# Altium project PCB_Project1.PrjPCB
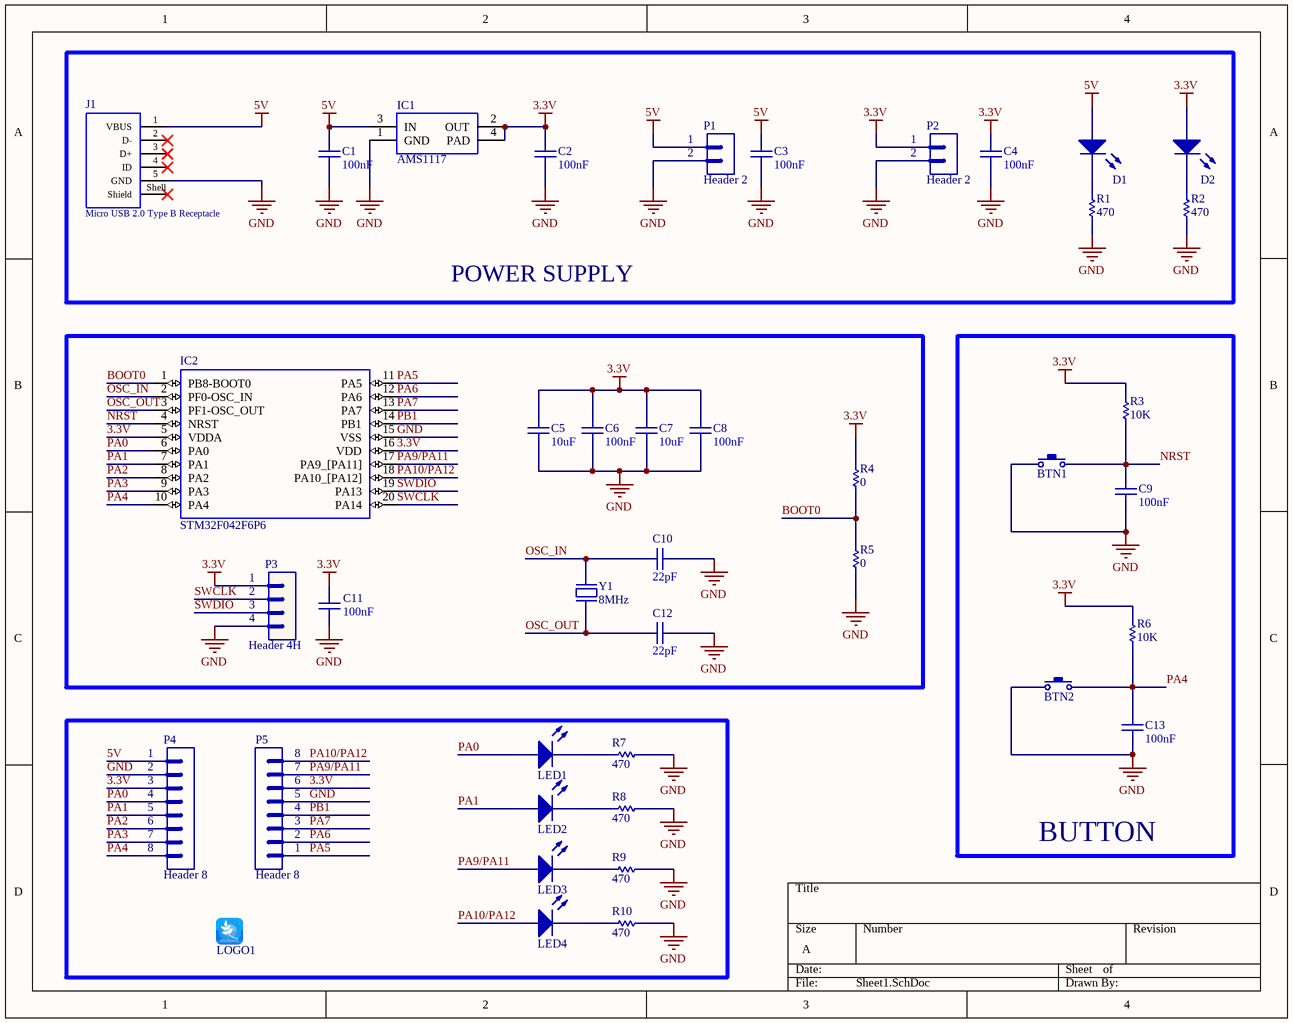
[diagram p0: Sheet1.SchDoc]
1 sheet, 41 parts. Net scope: global (net labels, ports and power ports of the same name join across sheets).
Board file: PCB1.PcbDoc

## Sheet Sheet1.SchDoc
size A

### Parts
BTN1  Button  [434123050836]  (value not drawn)
BTN2  Button  [434123050836]  (value not drawn)
C1  value 100nF  [CAP-SM-0805]  (hidden comment: Cap Non-Pol SMD)
C2  value 100nF  [CAP-SM-0805]  (hidden comment: Cap Non-Pol SMD)
C3  value 100nF  [CAP-SM-0805]  (hidden comment: Cap Non-Pol SMD)
C4  value 100nF  [CAP-SM-0805]  (hidden comment: Cap Non-Pol SMD)
C5  value 10uF  [CAP-SM-0805]  (hidden comment: Cap Non-Pol SMD)
C6  value 100nF  [CAP-SM-0805]  (hidden comment: Cap Non-Pol SMD)
C7  value 10uF  [CAP-SM-0805]  (hidden comment: Cap Non-Pol SMD)
C8  value 100nF  [CAP-SM-0805]  (hidden comment: Cap Non-Pol SMD)
C9  value 100nF  [CAP-SM-0805]  (hidden comment: Cap Non-Pol SMD)
C10  value 22pF  [CAP-SM-0805]  (hidden comment: Cap Non-Pol SMD)
C11  value 100nF  [CAP-SM-0805]  (hidden comment: Cap Non-Pol SMD)
C12  value 22pF  [CAP-SM-0805]  (hidden comment: Cap Non-Pol SMD)
C13  value 100nF  [CAP-SM-0805]  (hidden comment: Cap Non-Pol SMD)
D1  LED  [LED_0805_Blue]  (value not drawn)
D2  LED  [LED_0805_Blue]  (value not drawn)
IC1  AMS1117  [SOT223]
IC2  STM32F042F6P6  [TSSOP20]
J1  Micro USB 2.0 Type B Receptacle  [629105136821]
LED1  LED  [LED_0805_Blue]  (value not drawn)
LED2  LED  [LED_0805_Blue]  (value not drawn)
LED3  LED  [LED_0805_Blue]  (value not drawn)
LED4  LED  [LED_0805_Blue]  (value not drawn)
LOGO1  LOGO PIF  [PIF LOGO BOTTOM OVERLAY]  (value not drawn)
P1  Header 2  [JP2]
P2  Header 2  [JP2]
P3  Header 4H  [JP4H]
P4  Header 8  [JP8]
P5  Header 8  [JP8]
R1  value 470  [RES-SM-0805]  (hidden comment: Resistor 1/4W)
R2  value 470  [RES-SM-0805]  (hidden comment: Resistor 1/4W)
R3  value 10K  [RES-SM-0805]  (hidden comment: Resistor 1/4W)
R4  value 0  [RES-SM-0805]  (hidden comment: Resistor 1/4W)
R5  value 0  [RES-SM-0805]  (hidden comment: Resistor 1/4W)
R6  value 10K  [RES-SM-0805]  (hidden comment: Resistor 1/4W)
R7  value 470  [RES-SM-0805]  (hidden comment: Resistor 1/4W)
R8  value 470  [RES-SM-0805]  (hidden comment: Resistor 1/4W)
R9  value 470  [RES-SM-0805]  (hidden comment: Resistor 1/4W)
R10  value 470  [RES-SM-0805]  (hidden comment: Resistor 1/4W)
Y1  8MHz  [XTAL]

### Blocks framed on the sheet
POWER SUPPLY: C1-C4 D1 D2 IC1 J1 P1 P2 R1 R2
BUTTON: BTN1 BTN2 C9 C13 R3 R6

### Nets
3.3V: C2.2 C4.2 C5.2 C6.2 C7.2 C8.2 C11.2 D2.1(A) IC1.2(OUT) IC1.4(PAD) IC2.5(VDDA) IC2.16(VDD) P2.1 P3.1 P4.3 P5.6 R3.2 R4.2 R6.2
5V: C1.2 C3.2 D1.1(A) IC1.3(IN) J1.1(VBUS) P1.1 P4.1
GND: BTN1.1 BTN2.1 C1.1 C2.1 C3.1 C4.1 C5.1 C6.1 C7.1 C8.1 C9.1 C10.2 C11.1 C12.1 C13.1 IC1.1(GND) IC2.15(VSS) J1.5(GND) P1.2 P2.2 P3.4 P4.2 P5.5 R1.1 R2.1 R5.1 R7.2 R8.2 R9.2 R10.2
BOOT0: IC2.1(PB8-BOOT0) R4.1 R5.2
NRST: BTN1.2 C9.2 IC2.4(NRST) R3.1
OSC_IN: C10.1 IC2.2(PF0-OSC_IN) Y1.2
OSC_OUT: C12.2 IC2.3(PF1-OSC_OUT) Y1.1
PA0: IC2.6(PA0) LED1.1(A) P4.4
PA1: IC2.7(PA1) LED2.1(A) P4.5
PA2: IC2.8(PA2) P4.6
PA3: IC2.9(PA3) P4.7
PA4: BTN2.2 C13.2 IC2.10(PA4) P4.8 R6.1
PA5: IC2.11(PA5) P5.1
PA6: IC2.12(PA6) P5.2
PA7: IC2.13(PA7) P5.3
PA9/PA11: IC2.17(PA9_[PA11]) LED3.1(A) P5.7
PA10/PA12: IC2.18(PA10_[PA12]) LED4.1(A) P5.8
PB1: IC2.14(PB1) P5.4
SWCLK: IC2.20(PA14) P3.2
SWDIO: IC2.19(PA13) P3.3
NetD1_2: D1.2(K) R1.2
NetD2_2: D2.2(K) R2.2
NetLED1_2: LED1.2(K) R7.1
NetLED2_2: LED2.2(K) R8.1
NetLED3_2: LED3.2(K) R9.1
NetLED4_2: LED4.2(K) R10.1

Not connected (* = marked no-connect by the designer): J1 2(D-)* 3(D+)* 4(ID)* Shell(Shield)*

### Library data of the parts
C1-C13 = Cap Non-Pol SMD: Capacitor
IC1 = AMS1117: Available in 1.8V, 2.5V, 2.85V, 3.3V, 5V, and  Adjustable Versions; Value: LM317
IC2 = STM32F042F6P6: ARMÂ® CortexÂ®-M0 STM32F0 Microcontroller IC 32-Bit 48MHz 32KB _32K x 8_ FLASH 20-TSSOP; MF: STMicroelectronics; Availability: Unavailable; SnapEDA_Link: https://www.snapeda.com/parts/STM32F042F6P6/STMicroelectronics/view-part/109253/?ref=snap; MP: STM32F042F6P6; Value: *; Price: None; Package: TSSOP-20 STMicroelectronics
J1 = 629105136821: Micro USB 2.0 Type B, Receptacle, Horizontal, SMT; Manufacturer: Wurth Elektronik; Rated Current: 1A; Pin Number: 5; Interface Type: Type B; Working Voltage: 30VAC; ComponentLink1Description: Manufacturer; ComponentLink1URL: http://www.we-online.de; ComponentLink2Description: Datasheet; ComponentLink2URL: https://katalog.we-online.com/em/datasheet/629105136821.pdf; Published Date: August 2020; Manufacturer Part Number: 629105136821; Gender: Receptacle; Type: Horizontal; Packaging: Tape and Reel; Operating Temperature: -40 to +105degC; Mounting Technology: SMT; Application: Micro USB 2.0
P1 P2 = Header 2: Header, 2-Pin; LatestRevisionDate: 17-Jul-2002; LatestRevisionNote: Re-released for DXP Platform.; Publisher: Altium Limited
P3 = Header 4H: Header, 4-Pin, Right Angle; LatestRevisionDate: 17-Jul-2002; LatestRevisionNote: Re-released for DXP Platform.; Publisher: Altium Limited
P4 P5 = Header 8: Header, 8-Pin; LatestRevisionDate: 17-Jul-2002; LatestRevisionNote: Re-released for DXP Platform.; Publisher: Altium Limited
R1-R10 = RES
Y1 = XTAL: Crystal For all Crystal 2pin